# EAGLE design extboard (EAGLE 6.2)
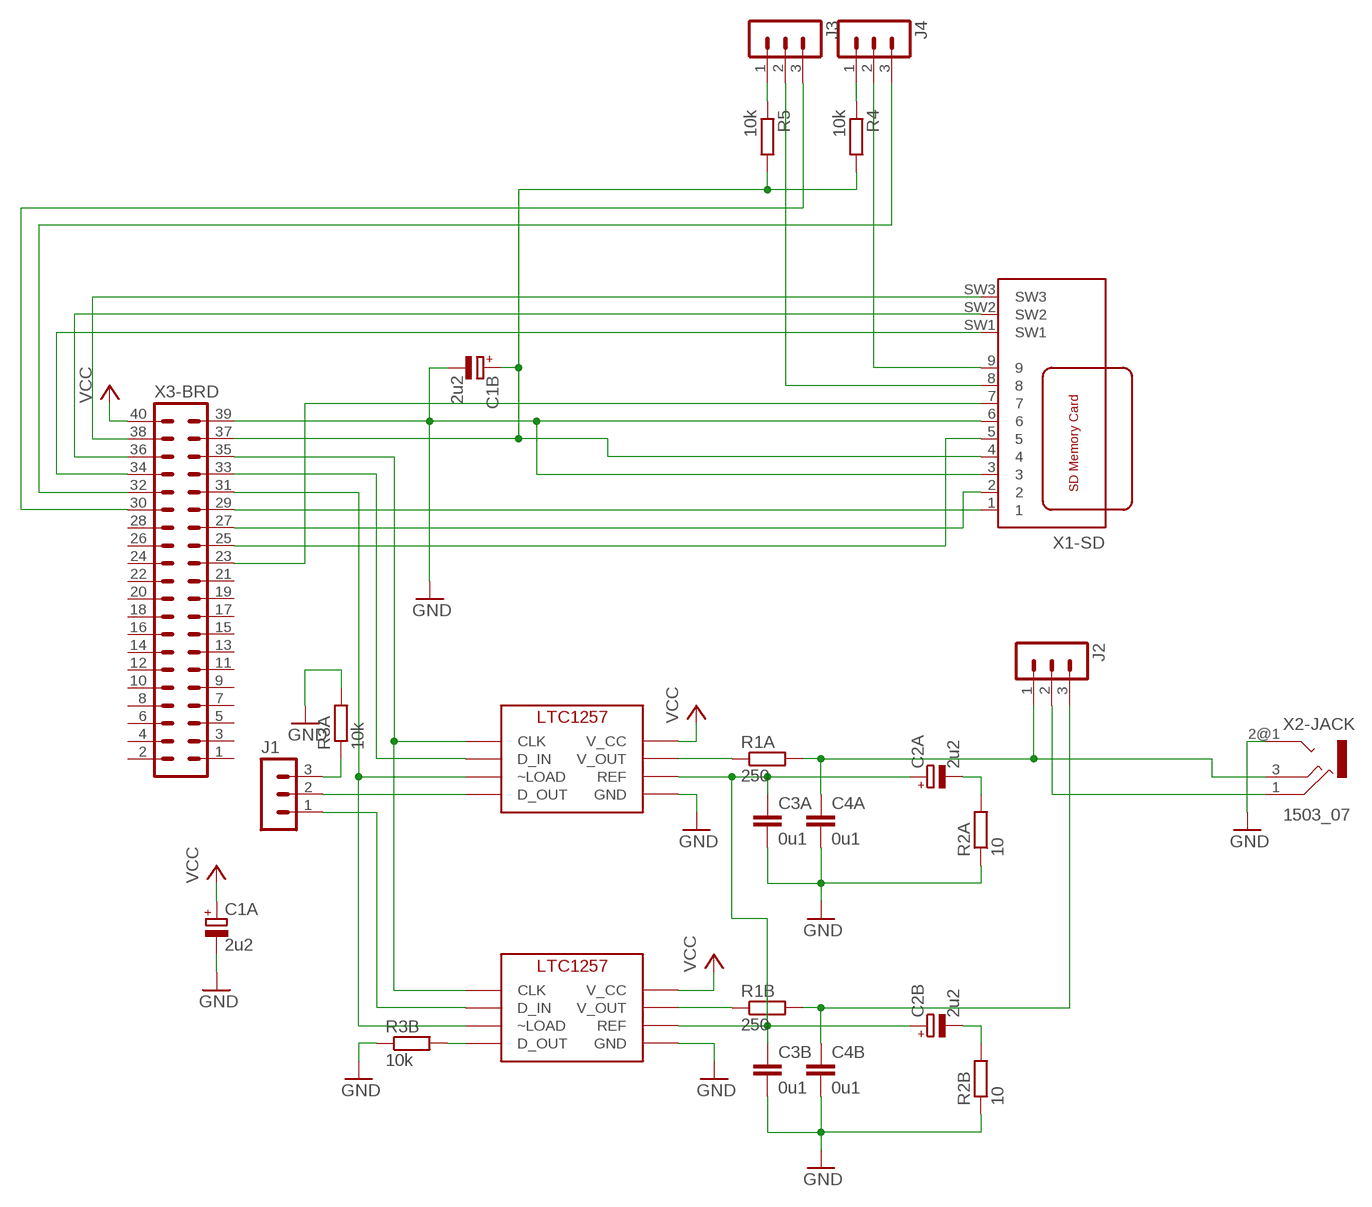
[diagram p0: schematic, sheet 1]

## Parts
C1A  2u2  CPOL-EUE2.5-7  [E2,5-7]
C1B  2u2  CPOL-EUE2.5-7  [E2,5-7]
C2A  2u2  CPOL-EUE2.5-7  [E2,5-7]
C2B  2u2  CPOL-EUE2.5-7  [E2,5-7]
C3A  0u1  C-EU050-025X075  [C050-025X075]
C3B  0u1  C-EU050-025X075  [C050-025X075]
C4A  0u1  C-EU050-025X075  [C050-025X075]
C4B  0u1  C-EU050-025X075  [C050-025X075]
J1  MA03-1  [MA03-1]
J2  MA03-1  [MA03-1]
J3  MA03-1  [MA03-1]
J4  MA03-1  [MA03-1]
R1A  250  R-EU_0207/10  [0207/10]
R1B  250  R-EU_0207/10  [0207/10]
R2A  10  R-EU_0207/10  [0207/10]
R2B  10  R-EU_0207/10  [0207/10]
R3A  10k  R-EU_0207/10  [0207/10]
R3B  10k  R-EU_0207/10  [0207/10]
R4  10k  R-EU_0207/10  [0207/10]
R5  10k  R-EU_0207/10  [0207/10]
U1  LTC1257  [DIL-8]
U2  LTC1257  [DIL-8]
X1-SD  SDBMF  [SDBMF-009XXBXX2]
X2-JACK  1503_07  [1503_07]
X3-BRD  MA20-2W  [MA20-2W]

## Nets
GND: C1A.- C1B.- C3A.2 C3B.2 C4A.2 C4B.2 R2A.1 R2B.1 R3A.2 R3B.1 U1.P$5(GND) U2.P$5(GND) X1-SD.3 X1-SD.6 X2-JACK.2@1 X3-BRD.39
N$1: U1.P$1(CLK) U2.P$1(CLK) X3-BRD.35
N$2: U1.P$2(D_IN) X3-BRD.33
N$3: U1.P$3(~LOAD) U2.P$3(~LOAD) X3-BRD.31
N$4: J1.1 U2.P$2(D_IN)
N$5: C2A.- R2A.2
N$6: C2A.+ C2B.+ C3A.1 C3B.1 U1.P$6(REF) U2.P$6(REF)
N$7: C4A.1 J2.1 R1A.2 X2-JACK.3
N$8: R1A.1 U1.P$7(V_OUT)
N$9: C1B.+ R4.2 R5.2 X1-SD.4 X3-BRD.37
N$10: J3.1 R5.1
N$12: X1-SD.1 X3-BRD.29
N$13: X1-SD.2 X3-BRD.27
N$14: X1-SD.5 X3-BRD.25
N$15: X1-SD.7 X3-BRD.23
N$16: J1.3 R3A.1
N$17: J1.2 U1.P$4(D_OUT)
N$18: J2.2 X2-JACK.1
N$19: R3B.2 U2.P$4(D_OUT)
N$21: C4B.1 J2.3 R1B.2
N$22: R1B.1 U2.P$7(V_OUT)
N$23: C2B.- R2B.2
N$24: X1-SD.SW1 X3-BRD.34
N$25: X1-SD.SW2 X3-BRD.36
N$26: X1-SD.SW3 X3-BRD.38
N$27: J4.1 R4.1
N$28: J3.2 X1-SD.8
N$29: J4.2 X1-SD.9
N$30: J4.3 X3-BRD.32
N$31: J3.3 X3-BRD.30
VCC: C1A.+ U1.P$8(V_CC) U2.P$8(V_CC) X3-BRD.40
Unconnected: X2-JACK.2@2 X3-BRD.1 X3-BRD.2 X3-BRD.3 X3-BRD.4 X3-BRD.5 X3-BRD.6 X3-BRD.7 X3-BRD.8 X3-BRD.9 X3-BRD.10 X3-BRD.11 X3-BRD.12 X3-BRD.13 X3-BRD.14 X3-BRD.15 X3-BRD.16 X3-BRD.17 X3-BRD.18 X3-BRD.19 X3-BRD.20 X3-BRD.21 X3-BRD.22 X3-BRD.24 X3-BRD.26 X3-BRD.28

## Library data of the parts
C1A C1B C2A C2B = rcl:CPOL-EU: POLARIZED CAPACITOR, European symbol
C3A C3B C4A C4B = rcl:C-EU: CAPACITOR, European symbol
J1-J4 = con-lstb:MA03-1: PIN HEADER; OC_FARNELL: unknown; OC_NEWARK: unknown
R1A R1B R2A R2B R3A R3B R4 R5 = rcl:R-EU_: RESISTOR, European symbol
U1 U2 = ltc1257:LTC1257
X1-SD = farnell-sd:SDBMF: SD MEMORY CARD PUSH-PUSH WITH CONNECTOR TYPE B (BIG SWUÌTCH #3) KINGFONT PRECISION INDUSTIAL CO., LTD Source: http://www.farnell.com/datasheets/74273.pdf Best.-Nr.: 9186174 Hersteller: MULTICOMP Herstellerbez.: SDBMF-00915B0T2
X2-JACK = con-lumberg:1503_?: Jack connectors according to JISC 6560, 3.5 mm Klinkensteckverbinder nach JISC 6560, 3,5 mm Source: http://www.lumberg.com/Produkte/PDFs/1503_08.pdf; OC_FARNELL: unknown; OC_NEWARK: unknown
X3-BRD = con-lstb:MA20-2W: PIN HEADER; OC_FARNELL: unknown; OC_NEWARK: unknown

## Board
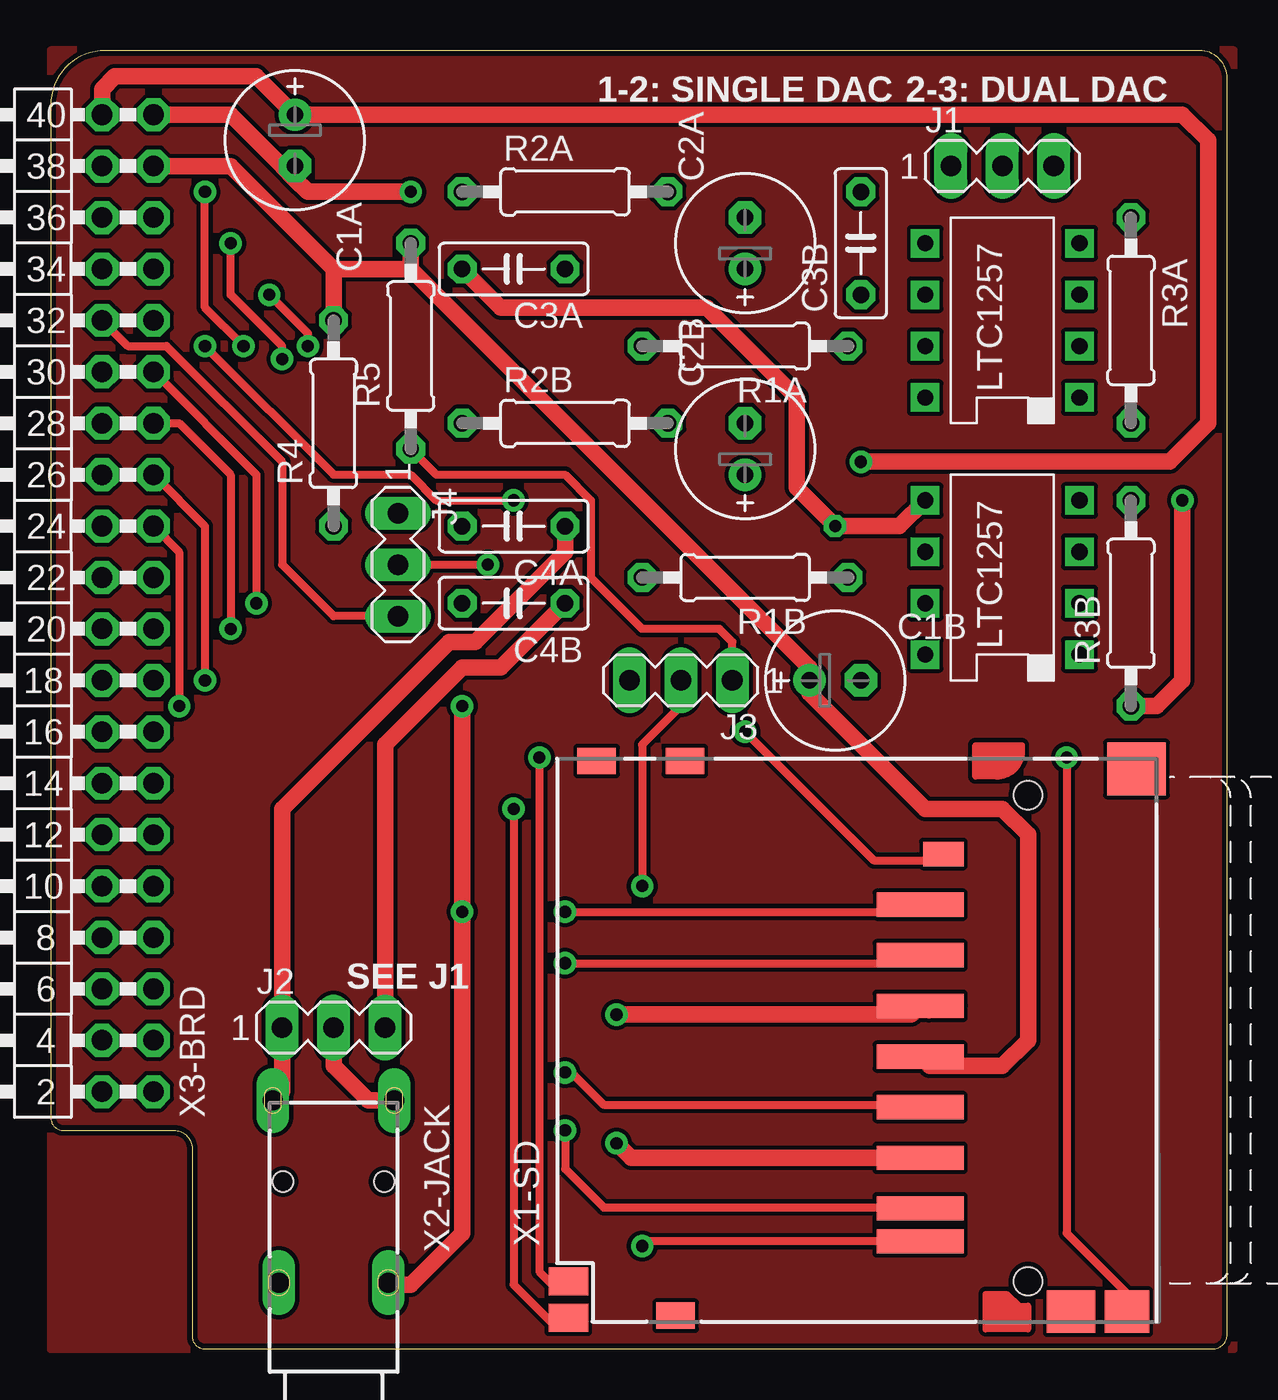
[diagram p1: board, top side]
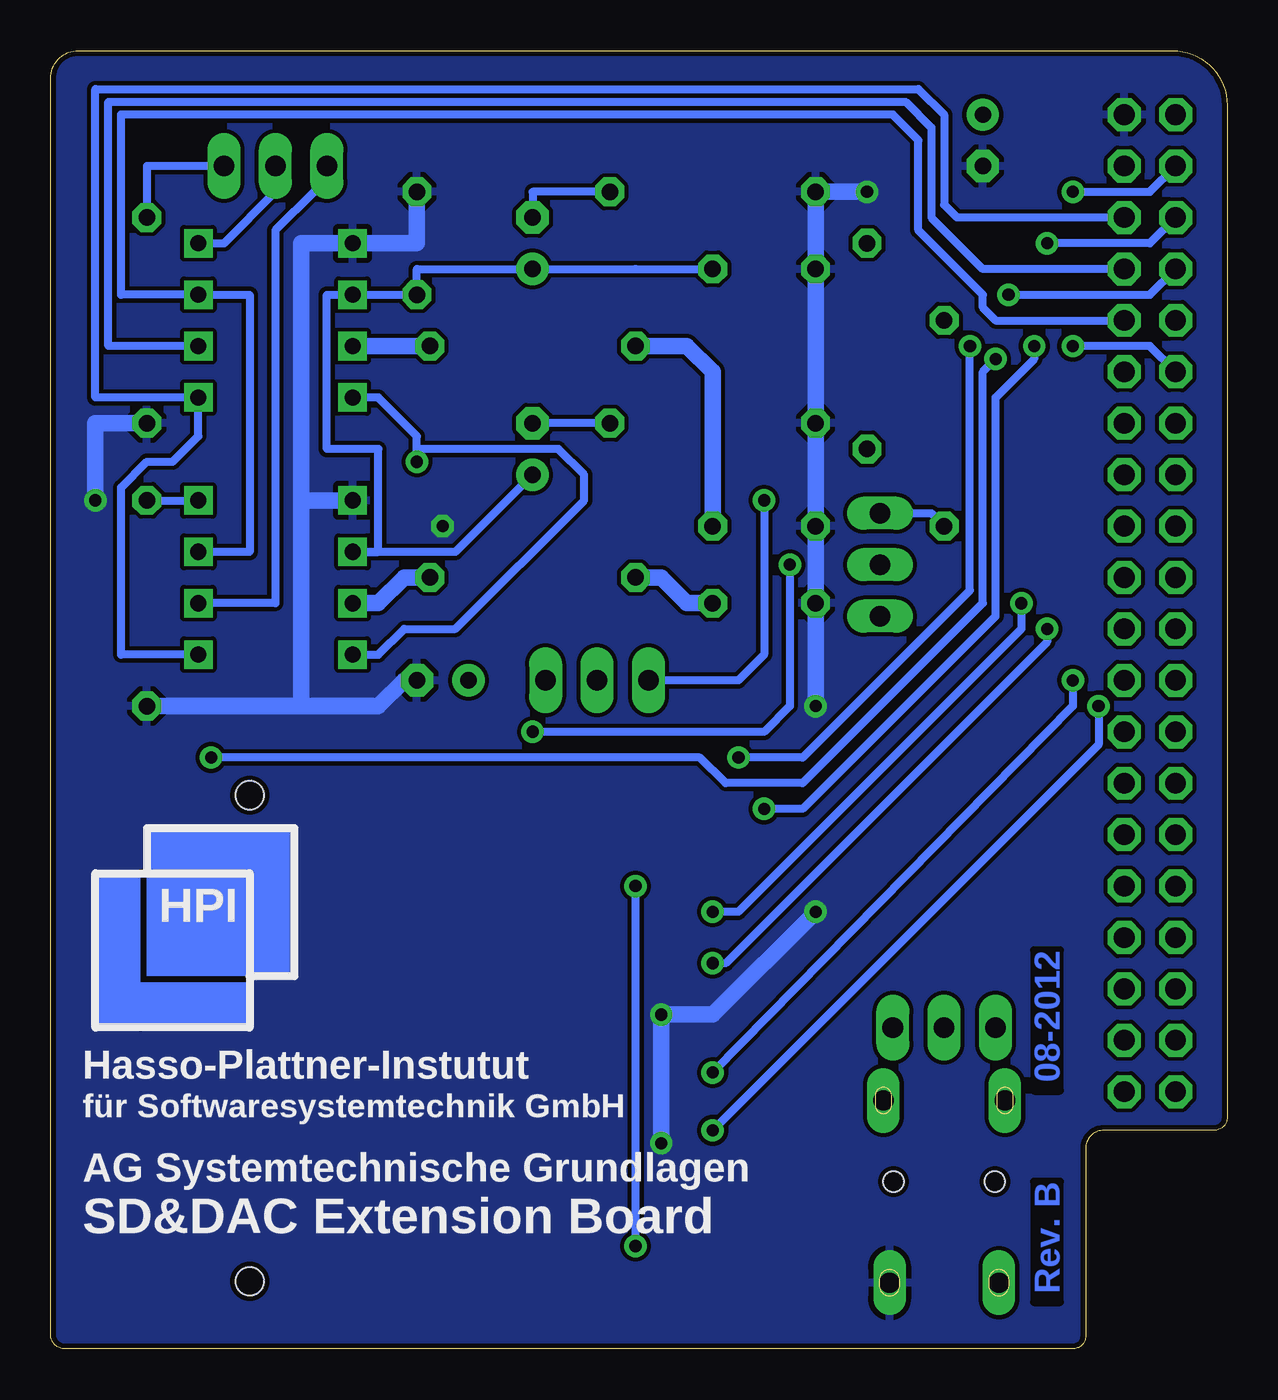
[diagram p2: board, bottom side, seen from below]

Size 58.09 x 64.12 mm. Coordinates in mm from the lower left corner, seen from the top.
Outline: 56.73,64.12 2.69,64.12 arc90 0,61.43 0,11.43 arc90 0.64,10.79 6.09,10.79 arc-90 6.99,9.9 6.99,0.64 arc90 7.62,0 57.39,0 arc90 58.09,0.7 58.09,62.76 arc90 56.73,64.12
Copper layers (1*16): Top 0.035mm / dielectric 1.5mm / Bottom 0.035mm
Design rules: minimum track width 8mil, minimum drill 20mil, track to track 8mil, track to pad 8mil, pad to pad 8mil, via to via 8mil, smd to smd 8mil, copper to edge 10mil, drill to drill 8mil, minimum pad ring 12mil, minimum via ring 10mil, stop-mask expansion 4mil, vias tented up to drill 25mil, thermal gap 10mil

### Footprints (pad centres in the part's own frame; a part is rotated, then mirrored left to right if it is on the bottom)
E2,5-7 = drill 0.813 pad 1.6: + -1.27,0 | drill 0.813 pad 1.6 octagon: - 1.27,0
C050-025X075 = drill 0.813 octagon: 1 -2.54,0; 2 2.54,0
MA03-1 = drill 1.016 long: 1 -2.54,0; 2 0,0; 3 2.54,0
0207/10 = drill 0.813 octagon: 1 -5.08,0; 2 5.08,0
DIL-8 = drill 0.8 square: P$1 -5.08,2.54; P$2 -5.08,0; P$3 -5.08,-2.54; P$4 -5.08,-5.08; P$5 2.54,-5.08; P$6 2.54,-2.54; P$7 2.54,0; P$8 2.54,2.54
SDBMF-009XXBXX2 = smd 1.2 x 4.3: 1 6.7,5.325; 2 4.2,5.325; 3 1.7,5.325; 4 -0.8,5.325; 5 -3.3,5.325; 6 -5.8,5.325; 7 -8.3,5.325; 8 -9.925,5.325 | smd 1.2 x 2: 9 9.2,4.175 | smd 2.1 x 2.4: M1 -13.4,-2.127 | smd 2.6 x 2.9: M2 13.4,-5.35 | smd 1.3 x 1.9: M3 -13.6,17.4; M4 13.8,16.95; M5 13.8,21.3 | smd 1.4 x 1.95: SW1 -11.9,22.7; SW3 -13.7,22.7 | smd 2.1 x 2.2: SW2 -13.4,-4.877 | hole 1.4: -11.9,0; 12.1,0
1503_07 = drill 1 pad 1.2 long: 1 -3,-11; 2@1 -2.7,-2; 2@2 2.7,-2; 3 3,-11 | hole 1: -2.5,-7; 2.5,-7
MA20-2W = drill 1.016 octagon: 1 -24.13,-1.27; 2 -24.13,1.27; 3 -21.59,-1.27; 4 -21.59,1.27; 5 -19.05,-1.27; 6 -19.05,1.27; 7 -16.51,-1.27; 8 -16.51,1.27; 9 -13.97,-1.27; 10 -13.97,1.27; 11 -11.43,-1.27; 12 -11.43,1.27; 13 -8.89,-1.27; 14 -8.89,1.27; 15 -6.35,-1.27; 16 -6.35,1.27; 17 -3.81,-1.27; 18 -3.81,1.27; 19 -1.27,-1.27; 20 -1.27,1.27; 21 1.27,-1.27; 22 1.27,1.27; 23 3.81,-1.27; 24 3.81,1.27; 25 6.35,-1.27; 26 6.35,1.27; 27 8.89,-1.27; 28 8.89,1.27; 29 11.43,-1.27; 30 11.43,1.27; 31 13.97,-1.27; 32 13.97,1.27; 33 16.51,-1.27; 34 16.51,1.27; 35 19.05,-1.27; 36 19.05,1.27; 37 21.59,-1.27; 38 21.59,1.27; 39 24.13,-1.27; 40 24.13,1.27

### Placement (x,y rotation side)
C1A  12.06,59.69 270 top
C1B  38.73,33.02 0 top
C2A  34.29,54.61 90 top
C2B  34.29,44.45 90 top
C3A  22.86,53.34 180 top
C3B  40.01,54.61 90 top
C4A  22.86,40.64 180 top
C4B  22.86,36.83 180 top
J1  46.99,58.42 0 top
J2  13.97,15.88 0 top
J3  31.11,33.02 180 top
J4  17.14,38.73 270 top
R1A  34.29,49.53 180 top
R1B  34.29,38.1 180 top
R2A  25.4,57.15 0 top
R2B  25.4,45.72 0 top
R3A  53.34,50.8 270 top
R3B  53.34,36.83 90 top
R4  13.97,45.72 90 top
R5  17.78,49.53 90 top
U1  45.72,49.53 180 top
U2  45.72,36.83 180 top
X1-SD  48.26,15.24 90 top
X2-JACK  13.97,1.27 180 top
X3-BRD  3.81,36.83 90 top

### Tracks (layer width: path | path; a pad name or v marks a point on that pad's centre or on a via)
GND  (via drill 0.6, 0.6 pad 0.41)
  Top 0.406: 43.37,16.51 X1-SD.3 44.88,16.94
  Top 0.813: v17.78,57.15 12.7,57.15 12.06,57.78 | v20.32,31.75 v20.32,21.59 20.32,5.71 17.78,3.18 16.77,3.18 X2-JACK.2@1 | U2.P$5 41.91,40.64 v38.73,40.64 36.83,42.54 36.83,46.99 32.38,51.43 22.23,51.43 C3A.2 | X1-SD.6 28.66,9.44 v27.94,10.16 | v27.94,16.51 42.51,16.51 X1-SD.3 | v55.88,41.91 55.88,33.02 54.61,31.75 R3B.1 | 12.06,57.78 C1A.- 11.43,58.42 | X3-BRD.39 8.89,60.96 11.43,58.42 | 11.43,58.42 12.06,57.78
  Bottom 0.813: 45.72,41.91 45.72,54.61 U1.P$5 40.01,54.61 C3B.2 | 45.72,41.91 U2.P$5 | R3B.1 45.72,31.75 | 45.72,31.75 45.72,41.91 | v20.32,31.75 C4B.2 C4A.2 R2B.1 C3A.2 R2A.1 v17.78,57.15 | R3A.2 55.88,45.72 v55.88,41.91 | v27.94,10.16 v27.94,16.51 25.4,16.51 v20.32,21.59 | C1B.- 40.64,33.02 41.91,31.75 45.72,31.75
  pour Bottom: 0,64.14 0,0 58.42,0 58.42,64.14
N$1
  Bottom 0.406: X3-BRD.35 13.34,55.88 13.97,56.51 13.97,60.96 15.24,62.23 55.88,62.23 55.88,46.99 U1.P$1 50.8,45.08 52.07,43.81 53.34,43.81 54.61,42.54 54.61,34.29 U2.P$1
N$2
  Bottom 0.406: U1.P$2 55.24,49.53 55.24,61.59 15.88,61.59 14.61,60.32 14.61,55.88 12.06,53.34 X3-BRD.33
N$3
  Bottom 0.406: U2.P$3 48.26,39.37 48.26,52.07 U1.P$3 54.61,52.07 54.61,60.96 16.51,60.96 15.24,59.69 15.24,55.24 12.06,52.07 12.06,51.43 11.43,50.8 X3-BRD.31
N$4
  Bottom 0.406: J1.1 44.45,57.15 45.09,57.15 46.99,55.24 46.99,36.83 U2.P$2
N$5
  Bottom 0.406: R2A.2 34.29,57.15 C2A.-
N$6
  Bottom 0.406: 29.21,53.34 C3A.1 C2A.+ 40.01,53.34 C3B.1 U1.P$6 44.45,52.07 44.45,44.45 41.91,44.45 41.91,39.37 U2.P$6 38.1,39.37 C2B.+
N$7
  Top 0.813: C4A.1 25.4,39.37 20.95,34.92 19.68,34.92 11.43,26.67 J2.1 11.43,12.73 X2-JACK.3
  Bottom 0.813: C4A.1 25.4,48.26 26.67,49.53 R1A.2
N$8
  Bottom 0.813: R1A.1 U1.P$7
N$9
  Top 0.813: X3-BRD.37 8.89,58.42 13.97,53.34 | 17.78,53.34 37.47,33.65 C1B.+ 37.47,32.38 43.18,26.67 46.99,26.67 48.26,25.4 48.26,15.24 46.99,13.97 43.41,13.97 X1-SD.4 | 17.78,53.34 13.97,53.34 | R4.2 13.97,53.34 | R5.2 17.78,53.34
N$10
  Top 0.406: R5.1 19.05,43.18 25.4,43.18 26.67,41.91 26.67,38.1 29.21,35.56 33.02,35.56 33.66,34.92 J3.1
N$12  (via drill 0.6)
  Top 0.406: v10.16,36.83 10.16,43.18 X3-BRD.29 | 42.59,21.91 42.62,21.94 X1-SD.1 42.59,21.59 v25.4,21.59
  Bottom 0.406: v10.16,36.83 10.16,35.56 24.13,21.59 v25.4,21.59
N$13  (via drill 0.6)
  Top 0.406: X3-BRD.27 6.35,45.72 8.89,43.18 v8.89,35.56 | 42.55,19.37 X1-SD.2 42.55,19.05 v25.4,19.05
  Bottom 0.406: v8.89,35.56 8.89,34.92 24.77,19.05 v25.4,19.05
N$14  (via drill 0.6)
  Top 0.406: X3-BRD.25 7.62,40.64 v7.62,33.02 | v25.4,13.65 25.72,13.65 27.3,12.07 42.81,12.07 X1-SD.5
  Bottom 0.406: v7.62,33.02 7.62,31.75 v25.4,13.65
N$15  (via drill 0.6)
  Top 0.406: X3-BRD.23 6.35,39.37 v6.35,31.75 | v25.4,10.79 25.4,8.89 27.3,6.99 42.89,6.99 X1-SD.7
  Bottom 0.406: v6.35,31.75 6.35,29.84 v25.4,10.79
N$16
  Bottom 0.406: J1.3 53.34,58.42 R3A.1
N$17
  Bottom 0.406: U1.P$4 49.53,54.61 46.99,57.15 J1.2
N$18
  Top 0.813: X2-JACK.1 15.67,12.27 13.97,13.97 J2.2
N$19
  Bottom 0.406: R3B.2 U2.P$4
N$20
  pour Top: 0,64.14 0,0 58.42,0 58.42,64.14
N$21
  Top 0.813: J2.3 16.51,29.84 20.32,33.65 22.23,33.65 C4B.1
  Bottom 0.813: C4B.1 26.67,36.83 27.94,38.1 R1B.2
N$22
  Bottom 0.813: R1B.1 40.64,38.1 41.91,36.83 U2.P$7
N$23
  Bottom 0.406: R2B.2 C2B.-
N$24  (via drill 0.6)
  Top 0.406: v24.13,29.21 24.13,3.81 24.77,3.18 25.39,3.18 X1-SD.SW1 | v12.7,49.53 12.7,50.16 v10.79,52.07
  Bottom 0.406: v24.13,29.21 20.95,29.21 12.7,37.46 v12.7,49.53 | v10.79,52.07 3.81,52.07 X3-BRD.34
N$25  (via drill 0.6)
  Top 0.406: X1-SD.SW2 53.34,2.04 53.34,2.54 50.16,5.71 v50.16,29.21 | v8.89,54.61 8.89,52.07 11.43,49.53 v11.43,48.89
  Bottom 0.406: v50.16,29.21 26.04,29.21 24.77,27.94 20.95,27.94 12.06,36.83 12.06,48.26 v11.43,48.89 | X3-BRD.36 3.81,54.61 v8.89,54.61
N$26  (via drill 0.6)
  Top 0.406: v22.86,26.67 22.86,3.18 24.77,1.27 25.29,1.27 X1-SD.SW3 | v9.53,49.53 7.62,51.43 v7.62,57.15
  Bottom 0.406: v22.86,26.67 20.95,26.67 11.43,36.2 11.43,46.99 9.53,48.89 v9.53,49.53 | v7.62,57.15 3.81,57.15 X3-BRD.38
N$27
  Bottom 0.406: J4.1 14.61,41.27 R4.1
N$28  (via drill 0.6)
  Top 0.406: X1-SD.8 29.45,5.31 v29.21,5.08 | J3.2 31.11,31.75 29.21,29.84 v29.21,22.86
  Bottom 0.406: v29.21,5.08 v29.21,22.86
N$29  (via drill 0.6)
  Top 0.406: J4.2 v21.59,38.73 | v34.29,30.48 40.64,24.13 43.77,24.13 X1-SD.9
  Bottom 0.406: v21.59,38.73 21.59,31.75 22.86,30.48 v34.29,30.48
N$30
  Top 0.406: X3-BRD.32 3.81,49.53 5.71,49.53 11.43,43.81 11.43,38.73 13.97,36.2 J4.3
N$31  (via drill 0.6 pad 0.41)
  Top 0.406: v7.62,49.53 13.97,43.18 17.78,43.18 19.05,41.91 v22.86,41.91
  Bottom 0.406: X3-BRD.30 3.81,49.53 v7.62,49.53 | v22.86,41.91 22.86,34.29 24.13,33.02 J3.3
VCC  (via drill 0.6 pad 0.41)
  Top 0.813: v40.01,43.81 55.24,43.81 57.15,45.72 57.15,59.69 55.88,60.96 C1A.+ 10.16,62.87 3.17,62.87 2.54,62.23 X3-BRD.40
  Bottom 0.406: v40.01,43.81 40.01,44.45 | 40.01,44.45 40.01,45.08 41.91,46.99 U1.P$8 | U2.P$8 41.91,34.29 40.64,35.56 38.1,35.56 31.75,41.91 31.75,43.18 33.02,44.45 40.01,44.45
(copper drawn outside any net)
  shapes: Bottom area x3

### Text on the board
Bottom: 08-2012 | Rev. B
tPlace: 1-2: SINGLE DAC | 2-3: DUAL DAC | SEE J1
bPlace: HPI | Hasso-Plattner-Instutut | für Softwaresystemtechnik GmbH | AG Systemtechnische Grundlagen | SD&DAC Extension Board